# EAGLE design ADF4351_Teensy (EAGLE 9.6.2)
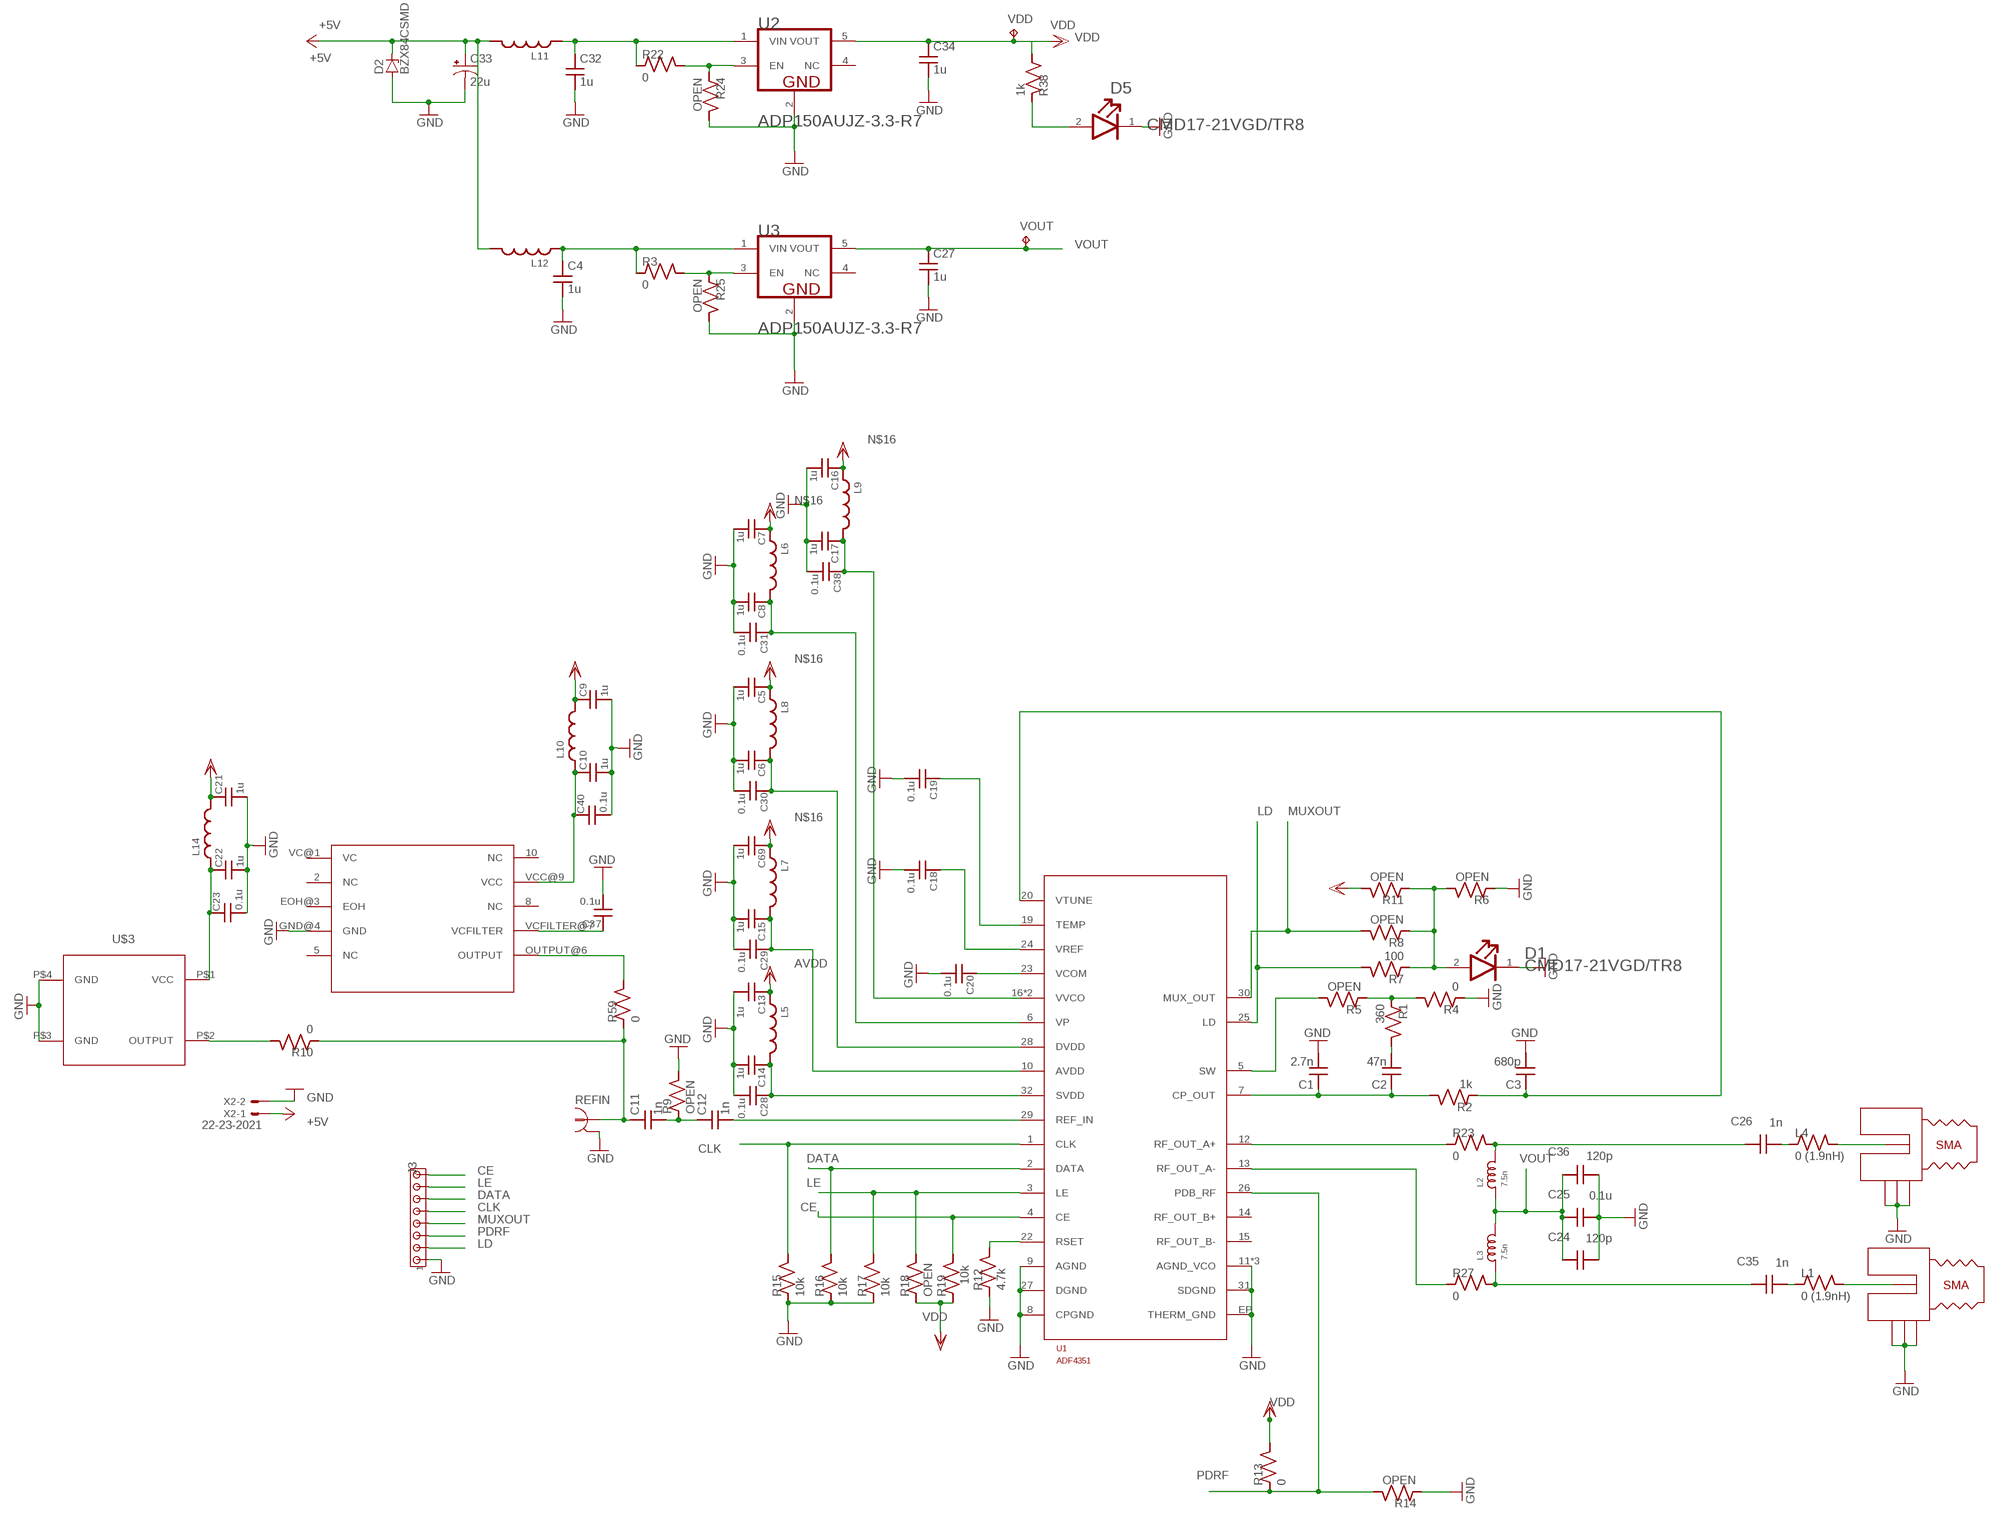
[diagram p0: schematic, sheet 1, part 1 of 2]
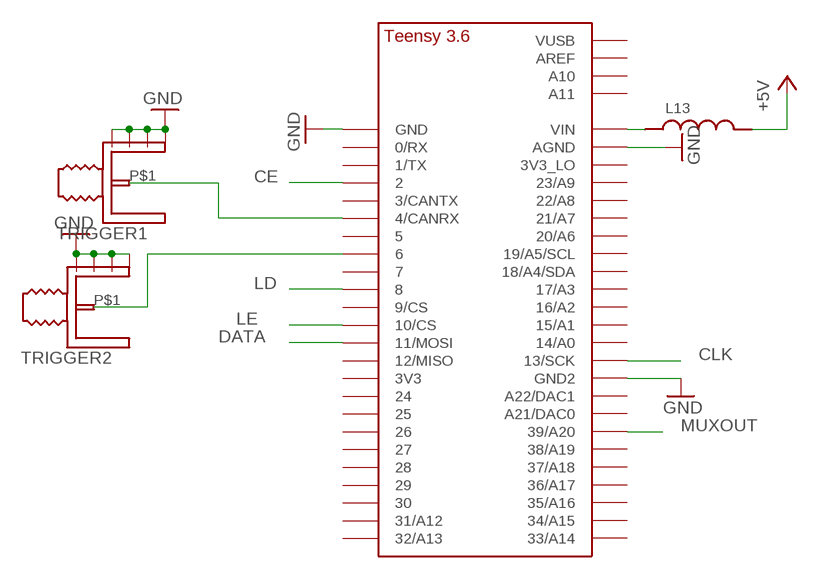
[diagram p1: schematic, sheet 1, part 2 of 2]

## Parts
535L250X2GT5  535L250X2GT5  [535L250X2GT5]
C1  2.7n  C_MLCC_SMDCMLCC_0603  [C_MLCC_0603]
C2  47n  C_MLCC_SMDCMLCC_0603  [C_MLCC_0603]
C3  680p  C_MLCC_SMDCMLCC_0603  [C_MLCC_0603]
C4  1u  C_MLCC_SMDCMLCC_0603  [C_MLCC_0603]
C5  1u  C_MLCC_SMDCMLCC_0306  [C_MLCC_0306]
C6  1u  C_MLCC_SMDCMLCC_0306  [C_MLCC_0306]
C7  1u  C_MLCC_SMDCMLCC_0306  [C_MLCC_0306]
C8  1u  C_MLCC_SMDCMLCC_0306  [C_MLCC_0306]
C9  1u  C_MLCC_SMDCMLCC_0306  [C_MLCC_0306]
C10  1u  C_MLCC_SMDCMLCC_0306  [C_MLCC_0306]
C11  1n  C_MLCC_SMDCMLCC_0603  [C_MLCC_0603]
C12  1n  C_MLCC_SMDCMLCC_0603  [C_MLCC_0603]
C13  1u  C_MLCC_SMDCMLCC_0306  [C_MLCC_0306]
C14  1u  C_MLCC_SMDCMLCC_0306  [C_MLCC_0306]
C15  1u  C_MLCC_SMDCMLCC_0306  [C_MLCC_0306]
C16  1u  C_MLCC_SMDCMLCC_0306  [C_MLCC_0306]
C17  1u  C_MLCC_SMDCMLCC_0306  [C_MLCC_0306]
C18  0.1u  C_MLCC_SMDCMLCC_0204  [C_MLCC_0204]
C19  0.1u  C_MLCC_SMDCMLCC_0204  [C_MLCC_0204]
C20  0.1u  C_MLCC_SMDCMLCC_0204  [C_MLCC_0204]
C21  1u  C_MLCC_SMDCMLCC_0306  [C_MLCC_0306]
C22  1u  C_MLCC_SMDCMLCC_0306  [C_MLCC_0306]
C23  0.1u  C_MLCC_SMDCMLCC_0204  [C_MLCC_0204]
C24  120p  C_MLCC_SMDCMLCC_0402  [C_MLCC_0402]
C25  0.1u  C_MLCC_SMDCMLCC_0402  [C_MLCC_0402]
C26  1n  C_MLCC_SMDCMLCC_0402  [C_MLCC_0402]
C27  1u  C_MLCC_SMDCMLCC_0603  [C_MLCC_0603]
C28  0.1u  C_MLCC_SMDCMLCC_0204  [C_MLCC_0204]
C29  0.1u  C_MLCC_SMDCMLCC_0204  [C_MLCC_0204]
C30  0.1u  C_MLCC_SMDCMLCC_0204  [C_MLCC_0204]
C31  0.1u  C_MLCC_SMDCMLCC_0204  [C_MLCC_0204]
C32  1u  C_MLCC_SMDCMLCC_0603  [C_MLCC_0603]
C33  22u  CPOL-USCT7343  [CT7343]
C34  1u  C_MLCC_SMDCMLCC_0603  [C_MLCC_0603]
C35  1n  C_MLCC_SMDCMLCC_0402  [C_MLCC_0402]
C36  120p  C_MLCC_SMDCMLCC_0402  [C_MLCC_0402]
C37  0.1u  C_MLCC_SMDCMLCC_0204  [C_MLCC_0204]
C38  0.1u  C_MLCC_SMDCMLCC_0204  [C_MLCC_0204]
C40  0.1u  C_MLCC_SMDCMLCC_0204  [C_MLCC_0204]
C69  1u  C_MLCC_SMDCMLCC_0306  [C_MLCC_0306]
D1  VISUAL_COMMUNICATIONS_CMD17-21VGD-TR8VISUAL_COMMUNICATIONS_CMD17-21VGD-TR8_0_0  [VISUAL_COMMUNICATIONS_CMD17-21VGD-TR8_0]
D2  BZX84CSMD  [TO236]
D5  VISUAL_COMMUNICATIONS_CMD17-21VGD-TR8VISUAL_COMMUNICATIONS_CMD17-21VGD-TR8_0_0  [VISUAL_COMMUNICATIONS_CMD17-21VGD-TR8_0]
J1  QKDLAB_JOSH_MECHANICAL_JOHNSON_SMA_18GHZ_142-0761-891  [QKDLAB_JOSH_MECHANICAL_JOHNSON_SMA_18GHZ_4-LAYER_142-0761-891]
J2  QKDLAB_JOSH_MECHANICAL_JOHNSON_SMA_18GHZ_142-0761-891  [QKDLAB_JOSH_MECHANICAL_JOHNSON_SMA_18GHZ_4-LAYER_142-0761-891]
J3  MTA08-100  [10X08MTA]
L1  0 (1.9nH)  R_SMDR0402  [R_0402]
L2  7.5n  INDUCTOR-0402  [0402]
L3  7.5n  INDUCTOR-0402  [0402]
L4  0 (1.9nH)  R_SMDR0402  [R_0402]
L5  L_FERRITE_SMDLFERRITE_0603  [L_FERRITE_0603]
L6  L_FERRITE_SMDLFERRITE_0603  [L_FERRITE_0603]
L7  L_FERRITE_SMDLFERRITE_0603  [L_FERRITE_0603]
L8  L_FERRITE_SMDLFERRITE_0603  [L_FERRITE_0603]
L9  L_FERRITE_SMDLFERRITE_0603  [L_FERRITE_0603]
L10  L_FERRITE_SMDLFERRITE_0603  [L_FERRITE_0603]
L11  L_FERRITE_SMDLFERRITE_0603  [L_FERRITE_0603]
L12  L_FERRITE_SMDLFERRITE_0603  [L_FERRITE_0603]
L13  L_FERRITE_SMDLFERRITE_0603  [L_FERRITE_0603]
L14  L_FERRITE_SMDLFERRITE_0603  [L_FERRITE_0603]
R1  360  R_SMDR0603  [R_0603]
R2  1k  R_SMDR0603  [R_0603]
R3  0  R_SMDR0603  [R_0603]
R4  0  R_SMDR0603  [R_0603]
R5  OPEN  R_SMDR0603  [R_0603]
R6  OPEN  R_SMDR0603  [R_0603]
R7  100  R_SMDR0603  [R_0603]
R8  OPEN  R_SMDR0603  [R_0603]
R9  OPEN  R_SMDR0603  [R_0603]
R10  0  R_SMDR0603  [R_0603]
R11  OPEN  R_SMDR0603  [R_0603]
R12  4.7k  R_SMDR0603  [R_0603]
R13  0  R_SMDR0603  [R_0603]
R14  OPEN  R_SMDR0603  [R_0603]
R15  10k  R_SMDR0603  [R_0603]
R16  10k  R_SMDR0603  [R_0603]
R17  10k  R_SMDR0603  [R_0603]
R18  OPEN  R_SMDR0603  [R_0603]
R19  10k  R_SMDR0603  [R_0603]
R22  0  R_SMDR0603  [R_0603]
R23  0  R_SMDR0402  [R_0402]
R24  OPEN  R_SMDR0603  [R_0603]
R25  OPEN  R_SMDR0603  [R_0603]
R27  0  R_SMDR0402  [R_0402]
R38  1k  R_SMDR0603  [R_0603]
R59  0  R_SMDR0603  [R_0603]
REFIN  SMA_CONNECTOR  [QKDLAB_JOSH_MECHANICAL_JOHNSON_SMA_EDGE_LAUNCH_142-0701-851]
TRIGGER1  JOHNSON_SMA_EDGE_LAUNCH_142-0701-851  [JOHNSON_SMA_EDGE_LAUNCH_142-0701-851]
TRIGGER2  JOHNSON_SMA_EDGE_LAUNCH_142-0701-851  [JOHNSON_SMA_EDGE_LAUNCH_142-0701-851]
U1  ADF4351  [ADF4351]
U2  ANALOG_DEVICES_ADP150AUJZ-3.3-R7ANALOG_DEVICES_ADP150AUJZ-3.3-R7_0_2  [ANALOG_DEVICES_ADP150AUJZ-3.3-R7_2]
U3  ANALOG_DEVICES_ADP150AUJZ-3.3-R7ANALOG_DEVICES_ADP150AUJZ-3.3-R7_0_2  [ANALOG_DEVICES_ADP150AUJZ-3.3-R7_2]
U$1  TEENSY_3.5/3.6_BASIC  [TEENSY_3.5/3.6_BASIC]
U$3  XNCLH25M000THJA0P0  [XNCLH25M000THJA0P0]
VDD  TPB1,27  [B1,27]
VOUT  TPB1,27  [B1,27]
X2  22-23-2021  [22-23-2021]

## Nets
+5V: C33.+ D2.C L11.P$2 L12.P$2 L13.P$2 X2.1
AVDD [chip_pin]: C15.P$1 C29.P$1 L7.P$2 U1.10(AVDD)
CE [chip_pin]: J3.8 R19.P$2 U1.4(CE) U$1.2
CLK [chip_pin]: J3.5 R15.P$2 U1.1(CLK) U$1.13/SCK
CPOUT: C1.P$1 C2.P$1 R2.P$2 U1.7(CP_OUT)
DATA [chip_pin]: J3.6 R16.P$2 U1.2(DATA) U$1.11/MOSI
DVDD [chip_pin]: C6.P$1 C30.P$1 L8.P$2 U1.28(DVDD)
GND: 535L250X2GT5.GND@4(GND) C1.P$2 C3.P$2 C4.P$2 C5.P$2 C6.P$2 C7.P$2 C8.P$2 C9.P$2 C10.P$2 C13.P$2 C14.P$2 C15.P$2 C16.P$2 C17.P$2 C18.P$2 C19.P$2 C20.P$2 C21.P$2 C22.P$2 C23.P$2 C24.P$2 C25.P$2 C27.P$2 C28.P$2 C29.P$2 C30.P$2 C31.P$2 C32.P$2 C33.- C34.P$2 C36.P$2 C37.P$2 C38.P$2 C40.P$2 C69.P$2 D1.1(CATHODE) D2.A D5.1(CATHODE) J1.P$2(GND) J1.P$3(GND) J1.P$4(GND) J2.P$2(GND) J2.P$3(GND) J2.P$4(GND) J3.1 R4.P$1 R6.P$1 R9.P$2 R12.P$1 R14.P$1 R15.P$1 R16.P$1 R17.P$1 R24.P$2 R25.P$2 REFIN.P$2 REFIN.P$3 REFIN.P$4 REFIN.P$5 TRIGGER1.P$2(GND1) TRIGGER1.P$3(GND) TRIGGER1.P$4(GND2) TRIGGER1.P$5(GND3) TRIGGER2.P$2(GND1) TRIGGER2.P$3(GND) TRIGGER2.P$4(GND2) TRIGGER2.P$5(GND3) U1.8(CPGND) U1.9(AGND) U1.11(AGND_VCO) U1.18(AGND_VCO) U1.21(AGND_VCO) U1.27(DGND) U1.31(SDGND) U1.EP(THERM_GND) U2.2(GND) U3.2(GND) U$1.AGND U$1.GND U$1.GND2 U$3.P$3(GND) U$3.P$4(GND) X2.2
LD [chip_pin]: J3.2 R7.P$2 U1.25(LD) U$1.8
LE [chip_pin]: J3.7 R17.P$2 R18.P$2 U1.3(LE) U$1.10/CS
MUXOUT [chip_pin]: J3.4 R8.P$2 U1.30(MUX_OUT) U$1.39/A20
N$1: C26.P$1 L2.2 R23.P$2
N$2: TRIGGER1.P$1 U$1.4/CANRX
N$3: TRIGGER2.P$1 U$1.6
N$4: C35.P$1 L3.1 R27.P$2
N$5: 535L250X2GT5.OUTPUT@6(OUTPUT) R59.P$2
N$6: C11.P$1 R10.P$1 R59.P$1 REFIN.P$1
N$7: 535L250X2GT5.VCC@9(VCC) C10.P$1 C40.P$1 L10.P$1
N$8: C11.P$2 C12.P$1 R9.P$1
N$9: 535L250X2GT5.VCFILTER@7(VCFILTER) C37.P$1
N$10: D1.2(ANODE) R6.P$2 R7.P$1 R8.P$1 R11.P$1
N$11: R1.P$1 R4.P$2 R5.P$1
N$12: C2.P$2 R1.P$2
N$14: C4.P$1 L12.P$1 R3.P$1 U3.1(VIN)
N$15: L13.P$1 U$1.VIN
N$17: C26.P$2 L4.P$1
N$18: C35.P$2 L1.P$1
N$19: J1.P$1(SIG) L4.P$2
N$20: J2.P$1(SIG) L1.P$2
N$21: R3.P$2 R25.P$1 U3.3(EN)
N$22: R22.P$2 R24.P$1 U2.3(EN)
N$23: C18.P$1 U1.24(VREF)
N$24: R10.P$2 U$3.P$2(OUTPUT)
N$25: C32.P$1 L11.P$1 R22.P$1 U2.1(VIN)
N$26: D5.2(ANODE) R38.P$1
N$27: C22.P$1 C23.P$1 L14.P$1 U$3.P$1(VCC)
PDRF [chip_pin]: J3.3 R13.P$1 R14.P$2 U1.26(PDB_RF)
REFIN: C12.P$2 U1.29(REF_IN)
RFOUTAM [chip_pin]: R27.P$1 U1.13(RF_OUT_A-)
RFOUTAP [chip_pin]: R23.P$1 U1.12(RF_OUT_A+)
RSET [chip_pin]: R12.P$2 U1.22(RSET)
SVDD [chip_pin]: C14.P$1 C28.P$1 L5.P$2 U1.32(SVDD)
SW: R5.P$2 U1.5(SW)
TEMP [chip_pin]: C19.P$1 U1.19(TEMP)
VCO [chip_pin]: C17.P$1 C38.P$1 L9.P$2 U1.16(VVCO) U1.17(VVCO)
VCOM [chip_pin]: C20.P$1 U1.23(VCOM)
VDD [chip_pin]: C5.P$1 C7.P$1 C9.P$1 C13.P$1 C16.P$1 C21.P$1 C34.P$1 C69.P$1 L5.P$1 L6.P$1 L7.P$1 L8.P$1 L9.P$1 L10.P$2 L14.P$2 R11.P$2 R13.P$2 R18.P$1 R19.P$1 R38.P$2 U2.5(VOUT) VDD.TP
VOUT: C24.P$1 C25.P$1 C27.P$1 C36.P$1 L2.1 L3.2 U3.5(VOUT) VOUT.TP
VP [chip_pin]: C8.P$1 C31.P$1 L6.P$2 U1.6(VP)
VTUNE [chip_pin]: C3.P$1 R2.P$1 U1.20(VTUNE)
Unconnected: 535L250X2GT5.2(NC) 535L250X2GT5.5(NC) 535L250X2GT5.8(NC) 535L250X2GT5.10(NC) 535L250X2GT5.EOH@3(EOH) 535L250X2GT5.VC@1(VC) U1.14(RF_OUT_B+) U1.15(RF_OUT_B-) U2.4(NC) U3.4(NC) U$1.0/RX U$1.1/TX U$1.3/CANTX U$1.3V3 U$1.3V3_LO U$1.5 U$1.7 U$1.9/CS U$1.12/MISO U$1.14/A0 U$1.15/A1 U$1.16/A2 U$1.17/A3 U$1.18/A4/SDA U$1.19/A5/SCL U$1.20/A6 U$1.21/A7 U$1.21/DAC0(A21/DAC0) U$1.22/A8 U$1.23/A9 U$1.24 U$1.25 U$1.26 U$1.27 U$1.28 U$1.29 U$1.30 U$1.31/A12 U$1.32/A13 U$1.33/A14 U$1.34/A15 U$1.35/A16 U$1.36/A17 U$1.37/A18 U$1.38/A19 U$1.A10 U$1.A11 U$1.A22/DAC1 U$1.AREF U$1.VUSB

## Library data of the parts
535L250X2GT5 = 535L250X2GT5:535L250X2GT5
C1 = jqi_passives:C_MLCC_SMD; DIGIKEY_PART_NUMBER: 1276-2022-1-ND; PART_NUMBER: CL10B272KB8NNNC
C2 = jqi_passives:C_MLCC_SMD; DIGIKEY_PART_NUMBER: 1276-2070-1-ND; PART_NUMBER: CL10B473JB8NNNC
C3 = jqi_passives:C_MLCC_SMD; DIGIKEY_PART_NUMBER: 1276-2327-1-ND; PART_NUMBER: CL10C681FB8NNNC
C4 C27 C32 C34 = jqi_passives:C_MLCC_SMD; DIGIKEY_PART_NUMBER: 1276-1019-1-ND; PART_NUMBER: CL10B105KO8NNNC
C5-C10 C13-C17 C21 C22 C69 = jqi_passives:C_MLCC_SMD; DIGIKEY_PART_NUMBER: 445-13750-1-ND; PART_NUMBER: C0816X5R1C105M050AC
C11 C12 = jqi_passives:C_MLCC_SMD; DIGIKEY_PART_NUMBER: 1276-1091-1-ND; PART_NUMBER: CL10C102JB8NNNC
C18-C20 C23 C28-C31 C37 C38 C40 = jqi_passives:C_MLCC_SMD; DIGIKEY_PART_NUMBER: 587-5137-1-ND; PART_NUMBER: LWK105C7104MP-F
C24 C36 = jqi_passives:C_MLCC_SMD; DIGIKEY_PART_NUMBER: 587-3738-1-ND; PART_NUMBER: UMK105CG121JVHF
C25 = jqi_passives:C_MLCC_SMD; DIGIKEY_PART_NUMBER: 587-1451-1-ND; PART_NUMBER: EMK105B7104KV-F
C26 C35 = jqi_passives:C_MLCC_SMD; DIGIKEY_PART_NUMBER: 1276-1635-1-ND; PART_NUMBER: CL05C102JB5NNNC
C33 = rcl:CPOL-US: POLARIZED CAPACITOR, American symbol; DIGIKEY_PART_NUMBER: 478-3923-1-ND; PART_NUMBER: TAJD226K020RNJ; SPICEPREFIX: C
D1 = Diode_TR8:VISUAL_COMMUNICATIONS_CMD17-21VGD-TR8: CHICAGO MINIATURE LIGHTING CMD17-21VGD/TR8 LED, GREEN, 1.25MM X 1.4MM, 7MCD, 570NM; CENTROID_NOT_SPECIFIED: No; COLOUR: Green; DATASHEET: https://www.vcclite.com/wp-content/uploads/wpallimport/files/files/CMD1721Seriesver3.pdf; DEVICE_CLASS_L1: Optoelectronics; DEVICE_CLASS_L2: LEDs; DEVICE_CLASS_L3: unset; DIGIKEY_DESCRIPTION: DIODE LED GREEN DIFFUSED 0805 SMD; DIGIKEY_PART_NUMBER: L62505CT-ND; FORWARD_CURRENT: 20mA; FORWARD_VOLTAGE: 2.1V; HEIGHT: 1.2mm; LEAD_FREE: yes; LED_ORIENTATION: Top View; LUMINOUS_INTENSITY: 7mcd; MF: Visual Communications; MFG_PACKAGE_IDENT: CMD17-21VGD/TR8; MFG_PACKAGE_IDENT_DATE: 0; MFG_PACKAGE_IDENT_REV: 0; MOUSER_DESCRIPTION: Standard LEDs - SMD GREEN DIFFUSED; MOUSER_PART_NUMBER: 606-CMD17-21VGD; MPN: CMD17-21VGD/TR8; PACKAGE: 0805 (2012 metric); POWER_DISSIPATION: 105mW; PREFIX: D; REVERSE_VOLTAGE: 5V; ROHS: yes; TEMPERATURE_RANGE_HIGH: +85°C; TEMPERATURE_RANGE_LOW: -40°C; VERIFICATION_VERSION: 0.0.0.1; VIEWING_ANGLE: 140°; WAVELENGTH: 570nm
D2 = diode:BZX84CSMD: Z DIODE; DIGIKEY_PART_NUMBER: 1727-2942-1-ND; PART_NUMBER: BZX84-C6V8,215
D5 = Diode_TR8:VISUAL_COMMUNICATIONS_CMD17-21VGD-TR8: CHICAGO MINIATURE LIGHTING CMD17-21VGD/TR8 LED, GREEN, 1.25MM X 1.4MM, 7MCD, 570NM; CENTROID_NOT_SPECIFIED: No; COLOUR: Green; DATASHEET: https://www.vcclite.com/wp-content/uploads/wpallimport/files/files/CMD1721Seriesver3.pdf; DEVICE_CLASS_L1: Optoelectronics; DEVICE_CLASS_L2: LEDs; DEVICE_CLASS_L3: unset; DIGIKEY_DESCRIPTION: DIODE LED GREEN DIFFUSED 0805 SMD; DIGIKEY_PART_NUMBER: L62501CT-ND; FORWARD_CURRENT: 20mA; FORWARD_VOLTAGE: 2.1V; HEIGHT: 1.2mm; LEAD_FREE: yes; LED_ORIENTATION: Top View; LUMINOUS_INTENSITY: 7mcd; MF: Visual Communications; MFG_PACKAGE_IDENT: CMD17-21VRD/TR8; MFG_PACKAGE_IDENT_DATE: 0; MFG_PACKAGE_IDENT_REV: 0; MOUSER_DESCRIPTION: Standard LEDs - SMD GREEN DIFFUSED; MOUSER_PART_NUMBER: 606-CMD17-21VGD; MPN: CMD17-21VRD/TR8; PACKAGE: 0805 (2012 metric); POWER_DISSIPATION: 105mW; PREFIX: D; REVERSE_VOLTAGE: 5V; ROHS: yes; TEMPERATURE_RANGE_HIGH: +85°C; TEMPERATURE_RANGE_LOW: -40°C; VERIFICATION_VERSION: 0.0.0.1; VIEWING_ANGLE: 140°; WAVELENGTH: 570nm
J1 J2 = SMA_connectors:QKDLAB_JOSH_MECHANICAL_JOHNSON_SMA_18GHZ_142-0761-891: Emerson 142-0761-891 High Frequency SMA End Launch Connector; DIGIKEY_PART_NUMBER: J802-ND; PART_NUMBER: 142-0761-891
J3 = con-amp:MTA08-100: AMP connector
L1 L4 R23 R27 = jqi_passives:R_SMD; DIGIKEY_PART_NUMBER: 541-1887-1-ND; PART_NUMBER: RCG04020000Z0ED
L2 L3 = rlc-jqi:INDUCTOR: SMT Inductor.; DIGIKEY_PART_NUMBER: A102558CT-ND; PART_NUMBER: 36501E7N5JTDG
L5-L14 = jqi_passives:L_FERRITE_SMD; DIGIKEY_PART_NUMBER: 490-17350-1-ND; PART_NUMBER: BLM18KG102SZ1D
R1 = jqi_passives:R_SMD; DIGIKEY_PART_NUMBER: P360GCT-ND; PART_NUMBER: ERJ-3GEYJ361V
R2 R38 = jqi_passives:R_SMD; DIGIKEY_PART_NUMBER: P1.0KDBCT-ND; PART_NUMBER: ERA-3AEB102V
R3 R4 R10 R13 R22 R59 = jqi_passives:R_SMD; DIGIKEY_PART_NUMBER: 541-4012-1-ND; PART_NUMBER: CRCW06030000Z0EAC
R5 R6 R8 R11 R14 R24 R25 = jqi_passives:R_SMD
R7 = jqi_passives:R_SMD; DIGIKEY_PART_NUMBER: 541-3951-1-ND; PART_NUMBER: CRCW0603100RFKEAC
R9 R15-R19 = jqi_passives:R_SMD; DIGIKEY_PART_NUMBER: MCT0603-10.0K-CFCT-ND; PART_NUMBER: MCT06030C1002FP500
R12 = jqi_passives:R_SMD; DIGIKEY_PART_NUMBER: 541-3993-1-ND; PART_NUMBER: CRCW06034K70JNEAC
REFIN = SMA_connectors:SMA_CONNECTOR; DIGIKEY_PART_NUMBER: J658-ND; PART_NUMBER: 142-0701-851
TRIGGER1 TRIGGER2 = connector-jqi:JOHNSON_SMA_EDGE_LAUNCH_142-0701-851
U1 = ADF4351:ADF4351: IC SYNTH PLL VCO 32LFCSP Check prices <https://pricing.snapeda.com/parts/ADF4351/Analog%20Devices/view-part?ref=eda>; AVAILABILITY: Bad; DESCRIPTION: IC SYNTH PLL VCO 32LFCSP; MF: Analog Devices; MP: ADF4351; PACKAGE: LFCSP-32 Analog Devices; PRICE: None
U2 U3 = Analog Devices - ADP150AUJZ-3.3-R7:ANALOG_DEVICES_ADP150AUJZ-3.3-R7: ADI-ADP1XX-UJ-5; CIIVA_IDS: 975179; CODE__JEDEC: MO-193-AB; COMPONENT_LINK_1_DESCRIPTION: Manufacturer URL; COMPONENT_LINK_1_URL: http://www.analog.com/en/index.html; COMPONENT_LINK_3_DESCRIPTION: Package Specification; COMPONENT_LINK_3_URL: http:/www.analog.com/static/imported-files/packages/PKG_PDF/TSOT(UJ)/UJ_5.pdf; COMPONENT_LINK_4_DESCRIPTION: URL Link1; COMPONENT_LINK_4_URL: Product URL:http://www.analog.com/en/ADP150/productSearch.html; DATASHEET: http://www.analog.com/static/imported-files/data_sheets/ADP150.pdf; DATASHEET_VERSION: Rev. A; FOOTPRINT_VARIANT_NAME_0: Level C; FOOTPRINT_VARIANT_NAME_1: Level B; FOOTPRINT_VARIANT_NAME_2: Level A; IMPORTED: yes; IMPORTED_FROM: vault; IMPORT_TS: 1521857608; IOUT_MAX: 150mA; MF: Analog Devices; MOUNTING_TECHNOLOGY: Surface Mount; MPN: ADP150AUJZ-3.3-R7; PACKAGE: UJ-5; PACKAGE_DESCRIPTION: 5-Pin Thin Small Outline Transistor Package, Body 2.9 x 1.6 mm, Pitch 0.95 mm; PACKAGE_VERSION: 100708-A, 10/2008; PACKING: Reel; PREFIX: U; PRESET_VOUT_VALUES_V: 3.3; RELEASE_DATE: 1391079503; SUPPLY_CURRENT_IGND__SMALL_LOAD: 10uA; VAULT_GUID: 70507598-8A6A-4FF9-A6C4-4DAE49C689A6; VAULT_REVISION: BD3AA6A0-0F13-46D0-8547-DEEA94063516; VIN_MAX_V: 5.5; VIN_MIN_V: 2.2
U$1 = Teensy356:TEENSY_3.5/3.6_BASIC
U$3 = XNCLH25M000THJA0P0:XNCLH25M000THJA0P0; DIGIKEY_PART_NUMBER_25: 490-XNCLH25M000CHJB9P0CT-ND; DIGIKEY_PART_NUMBER_50: 490-18056-1-ND; PART_NUMBER_25: XNCLH25M000CHJB9P0; PART_NUMBER_50: XNCLH50M000CHJA1P0
VDD VOUT = testpad:TP: Test pad
X2 = con-molex:22-23-2021: .100" (2.54mm) Center Header - 2 Pin; MF: MOLEX; MPN: 22-23-2021; OC_FARNELL: 1462926; OC_NEWARK: 25C3832

## Net classes
0 default: width 0.254 mm, drill 0.254 mm, clearance 0.254 mm
1 chip_pin: width 0.254 mm, drill 0.254 mm, clearance 0.127 mm to class 0, clearance 0.127 mm

## Board
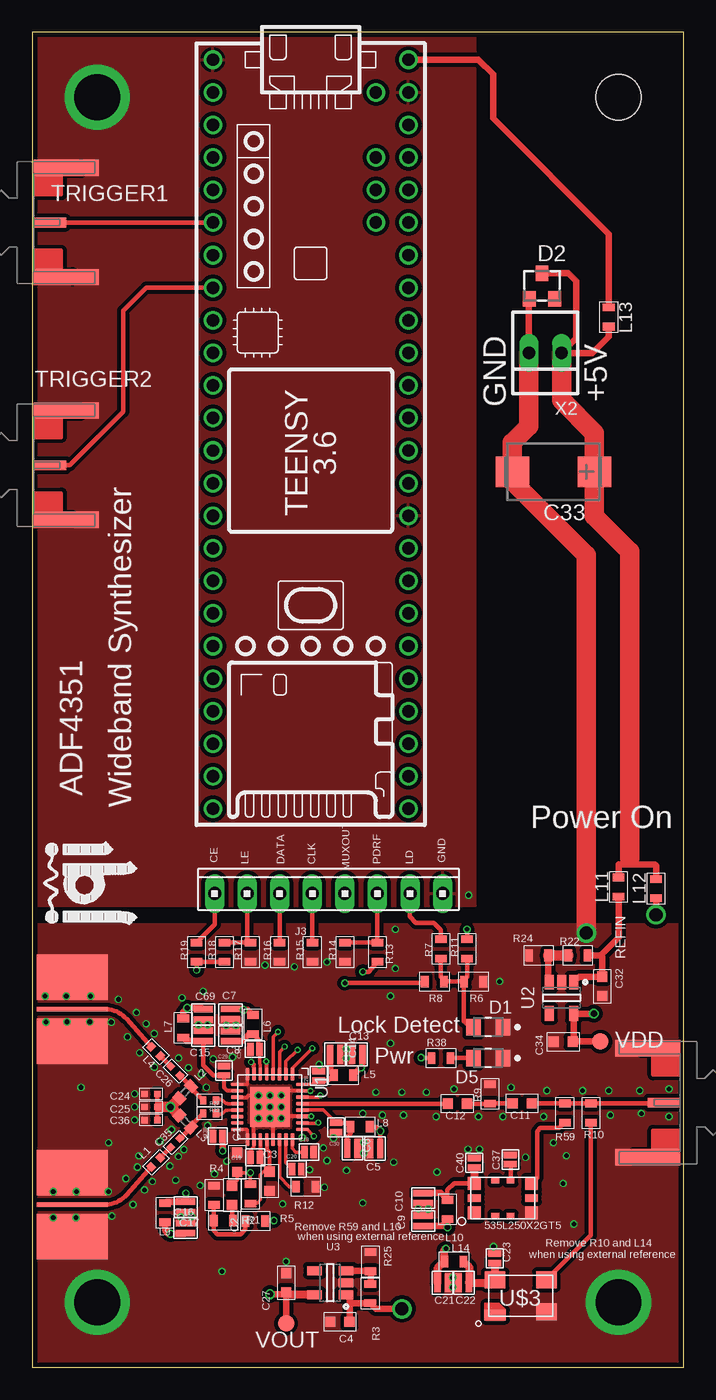
[diagram p2: board, top side]
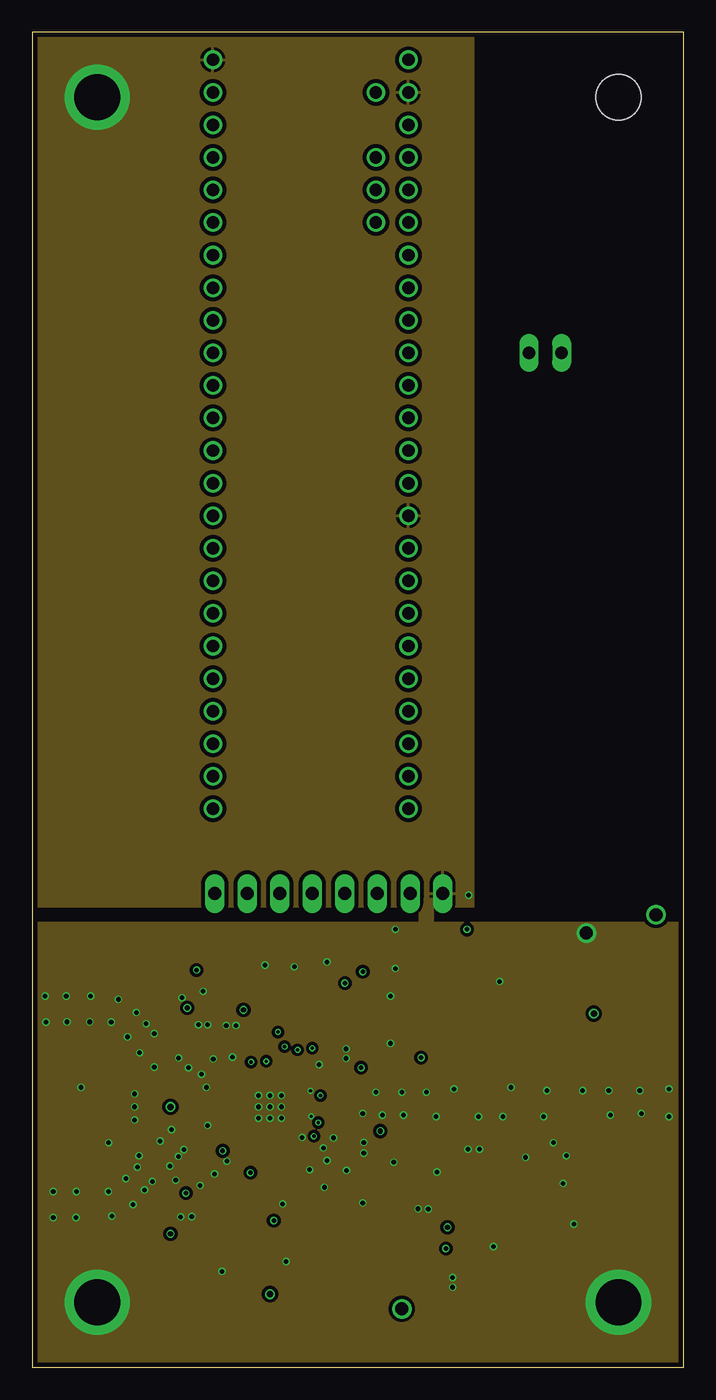
[diagram p3: board, inner layer Route2]
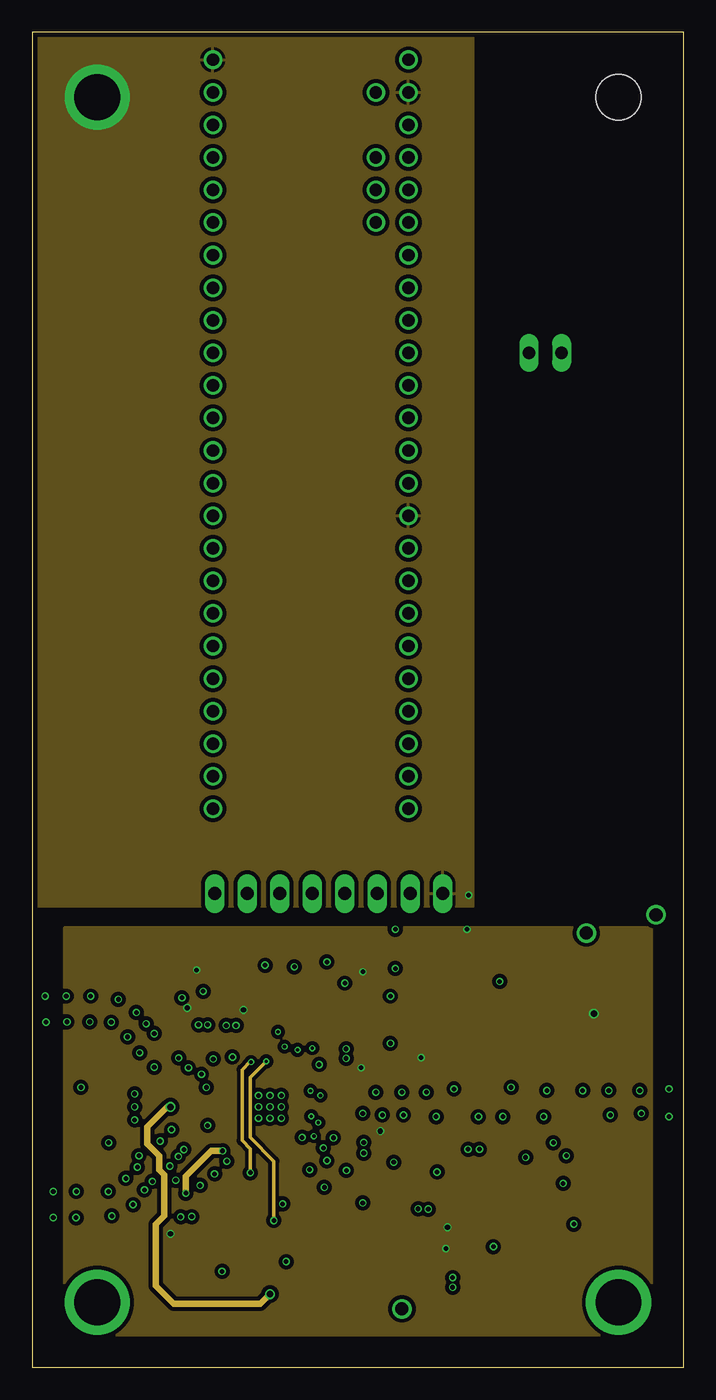
[diagram p4: board, inner layer Route15]
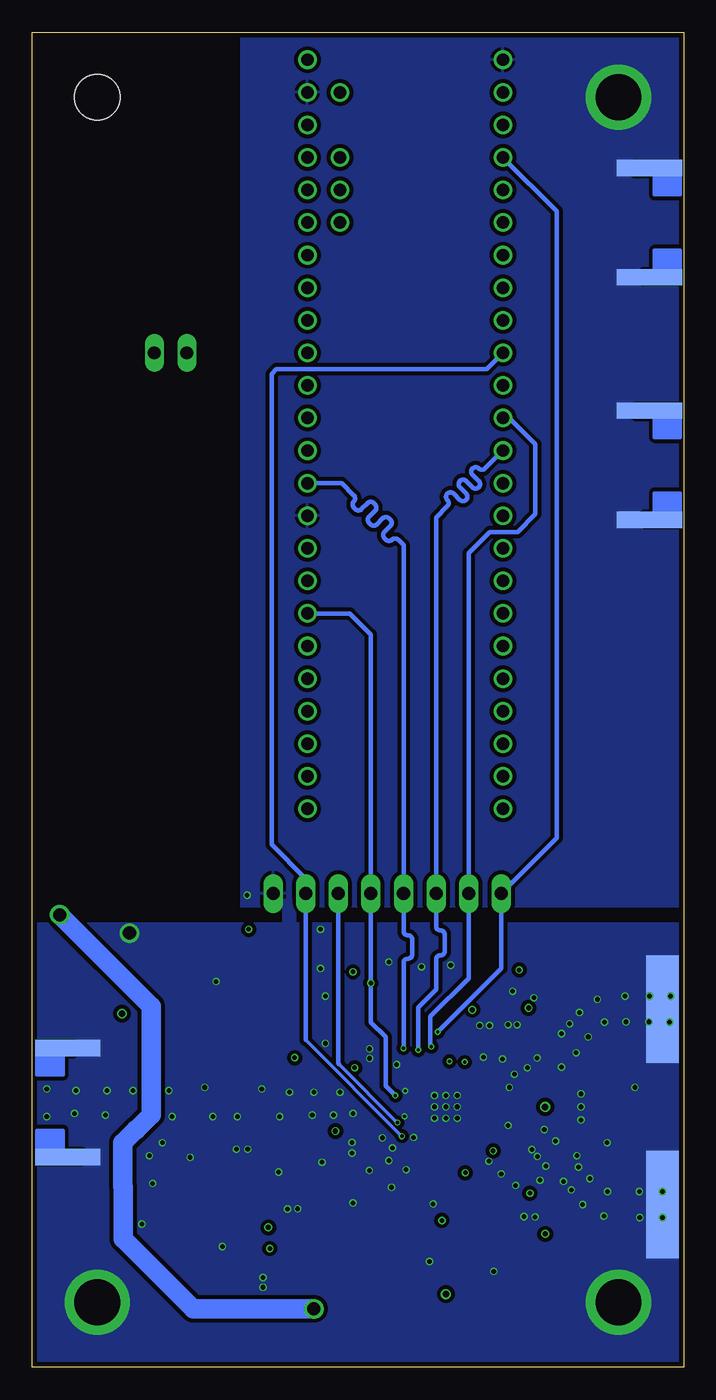
[diagram p5: board, bottom side, seen from below]

Size 50.8 x 104.14 mm. Coordinates in mm from the lower left corner, seen from the top.
Outline: 0,0 50.8,0 50.8,104.14 0,104.14 0,0
Copper layers (1*2*15*16): Top 0.035559375mm / dielectric 0.17018125mm / Route2 0.01778125mm / dielectric 47mil / Route15 0.01778125mm / dielectric 0.17018125mm / Bottom 0.035559375mm
Design rules "oshpark-4layer": minimum track width 5mil, minimum drill 10mil, track to track 5mil, track to pad 5mil, pad to pad 5mil, via to via 5mil, smd to smd 5mil, copper to edge 15mil, drill to drill 6mil, minimum pad ring 4mil, minimum via ring 4mil, stop-mask expansion 1.5mil, vias tented up to drill 0mil, thermal gap 10mil
Holes 3.56 mm at 45.72,99.06

### Footprints (pad centres in the part's own frame; a part is rotated, then mirrored left to right if it is on the bottom)
535L250X2GT5 = smd 0.6 x 0.5: 2 -0.6,-1.4; 8 -0.6,1.4; EOH@3 0.6,-1.4; VCFILTER@7 0.6,1.4 | smd 1 x 0.6: 5 2.225,0; 10 -2.225,0 | smd 1 x 1: GND@4 2.225,-1.15; OUTPUT@6 2.225,1.15; VC@1 -2.225,-1.15; VCC@9 -2.225,1.15
C_MLCC_0603 = smd 0.8 x 0.8: P$1 -0.75,0; P$2 0.75,0
C_MLCC_0306 = smd 0.5 x 1.5: P$1 -0.4,0; P$2 0.4,0
C_MLCC_0204 = smd 0.5 x 1: P$1 -0.36,0; P$2 0.36,0
C_MLCC_0402 = smd 0.5 x 0.5: P$1 -0.5,0; P$2 0.5,0
CT7343 = smd 2.6 x 2.4: + -3.2,0; - 3.2,0
VISUAL_COMMUNICATIONS_CMD17-21VGD-TR8_0 = smd 1.1 x 1.3: 1 -1.15,0; 2 1.15,0
TO236 = smd 1 x 1.2: A -1,-1; C 0,1; NC 1,-1
QKDLAB_JOSH_MECHANICAL_JOHNSON_SMA_18GHZ_4-LAYER_142-0761-891 = smd 0.356 x 5.537: P$1 0,-2.769 | smd 3.556 x 5.537: P$2 2.489,-2.769; P$3 -2.489,-2.769 | smd 8.382 x 2.54 bottom: P$4 0,-1.27
10X08MTA = drill 1.016 long: 1 8.89,0; 2 6.35,0; 3 3.81,0; 4 1.27,0; 5 -1.27,0; 6 -3.81,0; 7 -6.35,0; 8 -8.89,0
R_0402 = smd 0.5 x 0.6: P$1 -0.5,0; P$2 0.5,0
0402 = smd 0.7 x 0.9: 1 -0.65,0; 2 0.65,0
L_FERRITE_0603 = smd 0.6 x 0.9: P$1 -0.75,0; P$2 0.75,0
R_0603 = smd 0.6 x 0.9: P$1 -0.75,0; P$2 0.75,0
QKDLAB_JOSH_MECHANICAL_JOHNSON_SMA_EDGE_LAUNCH_142-0701-851 = smd 2.54 x 0.762: P$1 -1.27,0 | smd 5.08 x 1.27: P$2 -2.54,4.255; P$3 -2.54,-4.255 | smd 5.08 x 1.27 bottom: P$4 -2.54,4.255; P$5 -2.54,-4.255
JOHNSON_SMA_EDGE_LAUNCH_142-0701-851 = smd 2.54 x 0.762: P$1 -1.27,0 | smd 5.08 x 1.27: P$2 -2.54,4.255; P$3 -2.54,-4.255 | smd 5.08 x 1.27 bottom: P$4 -2.54,4.255; P$5 -2.54,-4.255
ADF4351 = smd 1 x 0.3: 1 -2.55,1.75; 2 -2.55,1.25; 3 -2.55,0.75; 4 -2.55,0.25; 5 -2.55,-0.25; 6 -2.55,-0.75; 7 -2.55,-1.25; 8 -2.55,-1.75; 17 2.55,-1.75; 18 2.55,-1.25; 19 2.55,-0.75; 20 2.55,-0.25; 21 2.55,0.25; 22 2.55,0.75; 23 2.55,1.25; 24 2.55,1.75 | smd 0.3 x 1: 9 -1.75,-2.55; 10 -1.25,-2.55; 11 -0.75,-2.55; 12 -0.25,-2.55; 13 0.25,-2.55; 14 0.75,-2.55; 15 1.25,-2.55; 16 1.75,-2.55; 25 1.75,2.55; 26 1.25,2.55; 27 0.75,2.55; 28 0.25,2.55; 29 -0.25,2.55; 30 -0.75,2.55; 31 -1.25,2.55; 32 -1.75,2.55 | smd 3.1 x 3.1: EP 0,0
ANALOG_DEVICES_ADP150AUJZ-3.3-R7_2 = smd 1.15 x 0.7: 1 -1.225,0.95; 2 -1.225,0; 3 -1.225,-0.95; 4 1.225,-0.95; 5 1.225,0.95
TEENSY_3.5/3.6_BASIC = drill 0.965: 0/RX -25.4,-7.62; 1/TX -22.86,-7.62; 2 -20.32,-7.62; 3/CANTX -17.78,-7.62; 3V3 7.62,-7.62; 3V3_LO -22.86,7.62; 4/CANRX -15.24,-7.62; 5 -12.7,-7.62; 6 -10.16,-7.62; 7 -7.62,-7.62; 8 -5.08,-7.62; 9/CS -2.54,-7.62; 10/CS 0,-7.62; 11/MOSI 2.54,-7.62; 12/MISO 5.08,-7.62; 13/SCK 5.08,7.62; 14/A0 2.54,7.62; 15/A1 0,7.62; 16/A2 -2.54,7.62; 17/A3 -5.08,7.62; 18/A4/SDA -7.62,7.62; 19/A5/SCL -10.16,7.62; 20/A6 -12.7,7.62; 21/A7 -15.24,7.62; 21/DAC0 12.7,7.62; 22/A8 -17.78,7.62; 23/A9 -20.32,7.62; 24 10.16,-7.62; 25 12.7,-7.62; 26 15.24,-7.62; 27 17.78,-7.62; 28 20.32,-7.62; 29 22.86,-7.62; 30 25.4,-7.62; 31/A12 27.94,-7.62; 32/A13 30.48,-7.62; 33/A14 30.48,7.62; 34/A15 27.94,7.62; 35/A16 25.4,7.62; 36/A17 22.86,7.62; 37/A18 20.32,7.62; 38/A19 17.78,7.62; 39/A20 15.24,7.62; A10 -17.78,5.08; A11 -15.24,5.08; A22/DAC1 10.16,7.62; AGND -25.4,7.62; AREF -20.32,5.08; GND -27.94,-7.62; GND2 7.62,7.62; VIN -27.94,7.62; VUSB -25.4,5.08
XNCLH25M000THJA0P0 = smd 1.6 x 1.3: P$1 -2,1.25; P$2 2,1.25; P$3 2,-1.25 | smd 1.676 x 0.813: P$4 -2,-1.5
B1,27 = smd 1.27 x 1.27: TP 0,0
22-23-2021 = drill 1 long: 1 -1.27,0; 2 1.27,0

### Placement (x,y rotation side)
535L250X2GT5  36.7,13.21 0 top
C1  16,16 90 top
C2  15.6,13.44 270 top
C3  18.52,14.53 270 top
C4  24,3.56 180 top
C5  26.75,17.07 180 top
C6  24.97,17.09 0 top
C7  15.47,27.56 270 top
C8  15.47,25.83 90 top
C9  30.48,11.43 90 top
C10  30.48,13.21 270 top
C11  38.2,20.6 180 top
C12  33.15,20.57 180 top
C13  25.35,24.41 180 top
C14  23.62,24.41 0 top
C15  13.34,25.86 90 top
C16  11.96,10.87 90 top
C17  11.99,12.52 270 top
C18  21.59,16.79 0 top
C19  17.4,16.38 180 top
C20  20.62,15.47 0 top
C21  32,6.6 0 top
C22  33.66,6.6 180 top
C23  36.07,8.51 90 top
C24  9.27,21.34 180 top
C25  9.27,20.32 180 top
C26  11.18,23.11 135 top
C27  19.81,6.6 90 top
C28  22.35,22.73 90 top
C29  14.96,23.14 90 top
C30  23.7,18.72 270 top
C31  17.37,24.82 180 top
C32  44.45,29.72 270 top
C33  40.64,69.85 180 top
C34  41.4,25.4 180 top
C35  11.18,17.53 225 top
C36  9.27,19.3 180 top
C37  37.29,16.21 90 top
C38  14.48,18.03 180 top
C40  34.47,15.95 90 top
C69  13.34,27.53 270 top
D1  35.56,26.54 180 top
D2  39.75,84.33 0 top
D5  35.56,24.13 180 top
J1  0.38,27.94 90 top
J2  0.38,12.7 90 top
J3  23.11,36.96 0 top
L1  9.65,16 225 top
L2  11.94,21.46 45 top
L3  11.94,19.18 135 top
L4  9.65,24.64 135 top
L5  24.28,22.81 180 top
L6  17.22,26.75 270 top
L7  11.79,26.47 270 top
L8  25.58,18.77 180 top
L9  10.36,12.07 90 top
L10  32.38,12.32 270 top
L11  45.72,37.46 90 top
L12  48.64,37.34 90 top
L13  44.96,81.92 270 top
L14  32.89,8.25 180 top
R1  14.91,11.46 0 top
R2  17.02,13.54 90 top
R3  26.37,5.77 90 top
R4  14.2,13.44 270 top
R5  17.4,11.43 0 top
R6  34.42,30.1 180 top
R7  31.88,32.64 90 top
R8  31.37,30.1 180 top
R9  35.69,21.34 90 top
R10  43.56,19.84 270 top
R11  33.91,32.64 90 top
R12  21.34,14.1 180 top
R13  26.92,32.38 270 top
R14  24.38,32.38 90 top
R15  21.84,32.38 90 top
R16  19.3,32.38 90 top
R17  17.02,32.38 90 top
R18  14.99,32.38 90 top
R19  12.83,32.38 90 top
R22  42.55,32.13 180 top
R23  13.84,20.83 180 top
R24  39.5,32.13 180 top
R25  26.39,8.25 90 top
R27  13.84,19.81 180 top
R38  31.88,24.13 180 top
R59  41.53,19.84 270 top
REFIN  50.55,20.65 0 top
TRIGGER1  0.13,89.28 180 top
TRIGGER2  0.13,70.36 180 top
U1  18.54,20.32 270 top
U2  41.27,28.83 270 top
U3  23.24,6.6 180 top
U$1  21.72,74.04 270 top
U$2  [JQI_LOGO_POSITIVE-SILKSCREEN]  7.87,34.29 90 top
U$3  38.1,5.59 0 top
VDD  44.3,25.43 0 top
VOUT  19.81,3.43 270 top
X2  40.01,79.12 180 top

### Tracks (layer width: path | path; a pad name or v marks a point on that pad's centre or on a via)
+5V
  Top 0.508: L11.P$2 45.72,39.24 46.1,39.24 | 46.1,39.24 48.51,39.24 48.64,39.12 L12.P$2 | D2.C 41.8,85.33 42.42,84.71 42.42,80.26 X2.1 43.69,79.12 44.96,80.39 L13.P$2 | 46.61,39.75 46.1,39.24
  Top 1.524: X2.1 41.27,75.44 43.84,72.87 C33.+ 43.84,66.4 46.61,63.63 46.61,39.75
AVDD
  Top 0.305: U1.10 15.23,21.57 14.99,21.82 14.99,22.75 C29.P$1
  Top 0.356: C29.P$1 14.12,22.78 13.34,23.56 C15.P$1
  Top 0.508: C15.P$1 12.04,25.46 L7.P$2
CE  (via drill 0.25)
  Top 0.254: U1.4 18.79,25.78 v19.18,26.16
  Top 0.356: J3.8 14.22,34.53 R19.P$2
  Bottom 0.356: v19.18,26.16 14.22,31.11 J3.8 9.91,41.27 9.91,90.17 U$1.2
CLK  (via drill 0.25)
  Top 0.254: U1.1 20.29,23.34 v21.84,24.89
  Top 0.356: J3.5 R15.P$2
  Bottom 0.356: v21.84,24.89 21.84,31.54 arc90 21.51,31.88 21.5,31.88 arc-90 21.16,32.21 21.16,33.36 arc-90 21.5,33.7 21.51,33.7 arc90 21.84,34.04 J3.5 21.84,64.14 22.27,64.56 arc-90 22.74,64.56 arc90 23.22,64.56 23.34,64.67 arc90 23.34,65.15 22.86,65.63 arc-90 22.86,66.1 22.98,66.22 arc-90 23.46,66.22 23.93,65.75 arc90 24.41,65.75 24.53,65.87 arc90 24.53,66.34 24.05,66.82 arc-90 24.05,67.29 24.17,67.41 arc-90 24.65,67.41 25.12,66.94 arc90 25.6,66.94 25.72,67.06 arc90 25.72,67.53 arc-90 25.72,68.01 26.67,68.96 U$1.13/SCK
CPOUT  (via drill 0.25, 0.36)
  Top 0.254: U1.7 17.29,23.39 | R2.P$2 v17.02,15.19 16.07,15.19 C1.P$1 16,14.59 C2.P$1
  Top 0.305: 17.29,23.39 17.29,23.6 v17.08,23.82
  Route15 0.254: v17.08,23.82 16.98,23.82 16.38,23.22 16.38,17.7 17.02,17.06 v17.02,15.19
DATA  (via drill 0.25)
  Top 0.254: U1.2 19.79,23.86 v20.7,24.77
  Top 0.356: J3.6 R16.P$2
  Bottom 0.356: v20.7,24.77 20.7,28.07 19.3,29.46 19.3,31.8 arc90 18.97,32.14 arc-90 18.63,32.47 18.63,33.74 arc-90 18.97,34.08 arc90 19.3,34.42 J3.6 19.3,66.29 18.43,67.17 arc-90 18.43,67.65 18.43,67.66 arc90 18.43,68.13 18.42,68.15 arc90 17.94,68.15 17.45,67.65 arc-90 16.97,67.65 16.96,67.67 arc-90 16.96,68.15 17.45,68.64 arc90 17.45,69.12 17.44,69.13 arc90 16.96,69.13 16.47,68.64 arc-90 15.99,68.64 15.97,68.65 arc-90 15.97,69.13 16.47,69.62 arc90 16.47,70.1 16.45,70.11 arc90 15.98,70.11 15.97,70.1 arc-90 15.49,70.1 U$1.11/MOSI
DVDD
  Top 0.254: U1.28 22.71,20.07 C30.P$1
  Top 0.356: C30.P$1 24.52,19.08 L8.P$2 24.83,18.25 24.56,17.98 C6.P$1
GND  (via drill 0.25, 0.36, 1.02, 3.56 pad 5.08)
  Top 0.254: U1.9 16.79,22.07 U1.8 | U1.31 v21.7,21.56 v21.71,21.57 | U1.18 17.29,17.19 17.04,16.94 C19.P$2
  Top 0.305: v19.43,19.43 19.57,19.57 U1.27 21.75,19.57 v21.77,19.58 | U1.11 16.75,21.07 16.89,21.21 v17.65,21.21 | U1.31 19.96,21.57 19.94,21.59 19.81,21.59 v19.43,21.21 | U1.18 17.29,19.07 v17.65,19.43 | U1.21 18.79,19.18 v18.54,19.43
  Top 0.508: X2.2 38.73,83.31 D2.A
  Top 1.524: X2.2 38.73,73.41 37.44,72.11 C33.- 37.44,69.11 43.2,63.35 v43.2,33.88
  other vias: 1.65,13.72 3.45,13.72 5.94,13.72 7.32,14.73 8.2,15.62 8.33,16.51 9.98,17.65 10.87,18.54 1.65,11.68 3.43,11.68 6.22,11.81 7.87,12.7 8.76,13.84 9.37,14.5 10.74,15.7 11.4,16.46 11.84,16.99 13.69,18.87 1.09,26.92 2.72,26.95 4.5,26.95 6.17,26.92 7.44,25.78 8.38,24.54 9.53,23.42 1.02,28.96 2.67,28.96 4.57,28.96 6.73,28.7 8.13,27.69 8.89,26.8 9.53,26.04 12.19,23.37 13.59,21.84 15.62,24.21 14.81,7.49 49.66,21.72 47.37,21.59 44.96,21.59 42.93,21.59 40.13,21.59 37.34,21.84 32.89,21.72 30.73,21.46 28.83,21.46 26.8,21.46 27.3,19.68 25.78,19.81 28.96,19.68 31.5,19.56 34.8,19.56 36.7,19.56 39.88,19.56 45.09,19.68 47.5,19.81 49.66,19.56 5.08,99.06 5.08,5.08 45.72,5.08 8,20.32 3.81,21.84 5.97,17.53 19.81,8.25 25.78,12.83 21.06,17.93 28.19,16 23.5,17.91 30.1,12.37 38.48,16.38 40.64,17.53 41.4,14.35 41.66,16.51 36.45,30.1 22.99,31.62 20.45,31.24 18.16,31.37 18.54,21.21 17.65,20.32 18.54,20.32 19.43,20.32 8,21.34 8,19.3 11.2,14.61 22.99,16.13 13.34,29.34 11.68,28.83 34.04,36.83 15.9,26.67 15.14,26.67 22.38,23.62 24.49,24.84 24.49,24.1 25.86,17.55 25.86,16.71 13.21,22.86 31.57,15.24 12.98,26.72 13.69,26.72 14.12,24.05 11.43,24.13 24.51,15.37 30.89,12.34 33.99,17.02 34.87,17.02 42.24,11.18 28.32,34.16 28.32,31.11 27.94,25.27 27.94,28.96 11.58,11.73 12.45,11.76 14.22,15.09 13.11,14.2 19.53,12.75 15.19,16.08 22.78,14.05 21.64,15.42 22.71,17.12 32.79,7.01 32.79,6.25 35.97,9.42
  pour Top (isolate 0.305, rank 2, no thermals): 0,34.54 0,0 50.8,0 50.8,34.54
  pour Route2: 0,34.67 0,0 50.8,0 50.8,34.67
  pour Bottom (isolate 0.305, rank 2, no thermals): 0,34.67 0,0 50.8,0 50.8,34.67
  pour Bottom (isolate 0.305, rank 2): 0.13,104.01 34.54,104.1 34.54,35.94 0,35.94 0,103.89
  pour Top (isolate 0.305): 0.13,104.01 34.54,104.1 34.54,35.94 0,35.94 0,103.89
  pour Route2 (isolate 0.305): 0,35.94 34.42,35.94 34.42,104.01 0.13,104.01
  pour Bottom (isolate 0.203, no thermals): 30.23,36.45 31.24,36.45 31.24,33.91 30.23,33.91
  pour Route2 (isolate 0.203, no thermals): 30.23,36.58 31.24,36.58 31.24,34.04 30.23,34.04
  pour Route15 (isolate 0.305): 0,35.94 34.42,35.94 34.42,104.01 0.13,104.01
LD  (via drill 0.25)
  Top 0.254: U1.25 21.43,18.57 v21.97,18.03
  Top 0.356: R7.P$2 31.88,34.11 31.32,34.67 29.92,34.67 29.44,35.15 29.44,36.93 J3.2
  Bottom 0.254: 29.46,25.53 v21.97,18.03
  Bottom 0.356: U$1.8 15.37,77.85 31.75,77.85 32.13,77.47 32.13,40.77 29.46,38.1 J3.2 29.46,25.53
LE  (via drill 0.25)
  Top 0.254: U1.3 19.29,24.63 v19.68,25.02
  Top 0.356: R18.P$2 R17.P$2 16.76,33.49 J3.7
  Bottom 0.356: v19.68,25.02 19.75,25.09 19.76,25.09 19.76,27.36 16.76,30.35 J3.7 16.76,63.5 15.11,65.15 12.95,65.15 11.56,66.55 11.56,72.01 13.59,74.04 U$1.10/CS
MUXOUT  (via drill 0.25, 0.35)
  Top 0.254: U1.30 21.1,21.08 22.35,21.08 v22.48,21.21
  Top 0.356: R8.P$2 30.39,29.97 v24.38,29.97
  Bottom 0.356: U$1.39/A20 26.04,58.8 24.38,57.15 J3.4 v24.38,29.97 24.38,26.92 23.24,25.78 23.24,21.97 v22.48,21.21
N$1
  Top 0.356: C26.P$1 12.37,21.92 | 12.37,21.92 L2.2 | R23.P$2 12.37,21.8 12.37,21.92
N$2
  Top 0.356: TRIGGER1.P$1 U$1.4/CANRX
N$3
  Top 0.356: TRIGGER2.P$1 2.92,70.36 7.11,74.55 7.11,82.42 8.89,84.2 U$1.6
N$4
  Top 0.356: R27.P$2 12.4,18.87 L3.1 11.67,17.99 C35.P$1
N$5
  Top 0.356: 535L250X2GT5.OUTPUT@6 39.37,14.8 39.37,18.41 39.62,18.67 41.11,18.67 R59.P$2
N$6
  Top 0.356: REFIN.P$1 49.21,20.59 R10.P$1 R59.P$1 41.52,20.6 C11.P$1
N$7
  Top 0.356: C40.P$1 34.47,15.37 | L10.P$1 32.38,13.84 32.9,14.36 535L250X2GT5.VCC@9
  Top 0.508: C10.P$1 31.85,13.61 L10.P$1
  Top 0.635: 34.47,15.37 34.47,14.37 535L250X2GT5.VCC@9
N$8
  Top 0.356: C12.P$1 35.49,20.57 R9.P$1 C11.P$2
N$9
  Top 0.356: 535L250X2GT5.VCFILTER@7 37.3,15.83 C37.P$1
N$10
  Top 0.356: R11.P$1 33.91,30.44 R6.P$2 | R7.P$1 31.88,30.44 R8.P$1 R6.P$2 | R6.P$2 33.67,27 33.7,27 34.16,26.54 D1.2
N$11
  Top 0.356: 14.16,12.65 R1.P$1 14.16,10.68 14.45,10.39 16.26,10.39 16.64,10.77 16.64,11.42
  Top 0.508: R4.P$2 14.16,12.65 | 16.64,11.42 R5.P$1
N$12
  Top 0.356: C2.P$2 15.6,11.52
  Top 0.508: 15.6,11.52 R1.P$2
N$13
  cutout Top: 16.54,27.05 17.91,27.05 17.91,26.42 16.54,26.42
  cutout Top: 11.05,26.8 12.47,26.8 12.47,26.24 11.05,26.24
  cutout Top: 25.27,18.06 25.27,19.43 25.91,19.43 25.91,18.06
  cutout Top: 24,22.12 24,23.49 24.64,23.49 24.64,22.12
  cutout Top: 11.53,10.67 10.16,10.67 10.16,11.3 11.53,11.3
  cutout Top: 33.12,12.19 31.75,12.19 31.75,12.83 33.12,12.83
  cutout Top: 33.27,8.99 33.27,7.62 32.64,7.62 32.64,8.99
N$14  (via drill 1.02)
  Top 0.508: L12.P$1 v48.64,35.31 | v28.83,4.57 26.81,4.57 R3.P$1 24.82,5.02 24.75,5.08 | C4.P$1 24.75,5.08 | 24.75,5.08 24.75,5.37 U3.1
  Bottom 1.524: v48.64,35.31 41.5,28.17 41.5,19.71 42.7,18.52 43.71,17.5 43.71,14.12 43.69,14.1 43.69,10.03 38.23,4.57 v28.83,4.57
N$15
  Top 0.508: L13.P$1 44.96,88.39 35.94,97.41 35.94,100.84 34.8,101.98 U$1.VIN
N$17
  Top 0.356: L4.P$1 C26.P$2
N$18
  Top 0.356: C35.P$2 L1.P$1
N$19
  Top 0.254: J1.P$1 5.84,27.94
  Top 0.356: L4.P$2 7.37,27.18 arc44 5.84,27.94
N$20
  Top 0.254: J2.P$1 5.84,12.7
  Top 0.356: L1.P$2 7.37,13.46 arc-44 5.84,12.7 | L1.P$2
N$21
  Top 0.508: U3.3 26.34,7.55 R25.P$1 26.39,6.54 R3.P$2
N$22
  Top 0.508: R24.P$1 40.25,30.13 U2.3
  Top 0.813: R22.P$2 R24.P$1
N$23
  Top 0.254: U1.24 20.29,17.07 20.57,16.79 C18.P$1
N$24
  Top 0.356: R10.P$2 43.56,10.3 U$3.P$2
N$25
  Top 0.508: 44.32,32.13 44.45,32 C32.P$1 42.64,30.47 U2.1 | 44.32,32.13 R22.P$1 | L11.P$1 45.72,33.53 44.32,32.13
N$26
  Top 0.356: R38.P$1 D5.2
N$27
  Top 0.356: C23.P$1 36.07,8.06
  Top 0.61: C22.P$1 34.06,6.6 | 34.06,6.6 35.87,6.6 U$3.P$1 36.07,6.87 36.07,8.06 | L14.P$1 34.06,7.83 34.06,6.6
PDRF  (via drill 0.25)
  Top 0.254: U1.26 21.11,19.05 22.27,19.05 v22.31,19.09
  Top 0.356: R14.P$2 R13.P$1 J3.3
  Bottom 0.254: v22.31,19.09 26.84,23.62
  Bottom 0.356: J3.3 26.92,23.7 26.84,23.62
REFIN
  Top 0.356: U1.29 32.29,20.57 C12.P$2
RFOUTAM
  Top 0.254: U1.13 15.24,20.07 arc53 14.99,19.94 arc-83 R27.P$1
RFOUTAP
  Top 0.254: U1.12 15.24,20.57 arc-53 14.99,20.7 arc83 R23.P$1
RSET
  Top 0.254: U1.22 19.29,14.87 20.07,14.1 R12.P$2
SVDD
  Top 0.254: U1.32 22.05,22.07 C28.P$1
  Top 0.356: C28.P$1 23.1,22.37 L5.P$2 23.5,22.85
  Top 0.508: C14.P$1 23.22,23.51 23.23,23.5 23.23,23.11 23.5,22.85
SW  (via drill 0.25, 0.36)
  Top 0.305: U1.5 18.29,23.87 18.29,23.88 v18.26,23.88
  Top 0.356: R5.P$2 18.82,11.43 v18.85,11.45
  Route15 0.254: v18.85,11.45 18.85,16.08 16.99,17.93 16.99,22.61 v18.26,23.88
TEMP
  Top 0.254: 17.79,16.42 C19.P$1
  Top 0.305: U1.19 17.79,16.42
VCO  (via drill 0.36)
  Top 0.254: U1.16 16.74,18.57 16.74,18.52 16.79,18.52 U1.17
  Top 0.508: L9.P$2 10.47,12.92 C17.P$1 v11.99,13.59 | v14.86,16.89 14.86,18.01 C38.P$1
  Route15 0.508: v11.99,13.59 11.99,14.91 13.97,16.89 v14.86,16.89
  pour Top (isolate 0.203, no thermals): 14.86,17.78 14.86,18.16 14.99,18.29 15.49,18.29 15.62,18.41 15.62,18.54 16.64,18.54 16.76,18.41 16.76,17.65 16.64,17.53 16.38,17.53 15.37,17.53 15.11,17.78
VCOM
  Top 0.254: U1.23 19.79,15.94 C20.P$1
VDD  (via drill 0.35, 0.36, 0.4, 0.51)
  Top 0.356: R18.P$1 R19.P$1 v12.83,30.99 | R13.P$2 26.25,30.86 v25.78,30.86 | R11.P$2 v33.91,34.16 | 16.55,27.9 16.5,27.9 v16.48,27.89 | 10.63,10.41 v10.79,10.41 | L8.P$1 26.81,18.77 v27.15,18.43 C5.P$1 | R38.P$2 30.35,24.13 v30.33,24.15
  Top 0.508: C7.P$1 16.49,27.96 16.55,27.9 | v16.48,27.89 16.83,27.89 L6.P$1 | L5.P$1 25.59,23.37 v25.65,23.37 25.75,23.46 C13.P$1 | L7.P$1 11.79,27.74 v12.09,28.04 13.23,28.04 C69.P$1 | L10.P$2 v32.38,10.92 32.28,11.03 C9.P$1 | 42.23,25.43 U2.5 42.24,27.58 v43.79,27.58 | C34.P$1 42.18,25.43 VDD.TP | L9.P$1 10.36,10.68 10.63,10.41 11.91,10.41 C16.P$1
  Top 0.61: 42.23,25.43 C34.P$1 | v32.26,9.27 32.14,9.16 L14.P$2 31.6,7.72 C21.P$1
  pour Route15 (isolate 0.305): 2.54,34.29 2.54,2.54 48.26,2.54 48.26,34.29
VOUT  (via drill 0.51)
  Top 0.356: C24.P$1 C25.P$1 | C25.P$1 C36.P$1 | C25.P$1 9.95,20.32
  Top 0.508: VOUT.TP C27.P$1 19.67,5.71 v18.54,5.71
  Top 0.61: U3.5 19.91,5.65 C27.P$1
  Top 0.813: v10.79,20.32 L2.1 | L3.2 v10.79,20.32 | v10.79,20.32 | 9.95,20.32 v10.79,20.32 | v10.79,20.32
  Route15 0.508: v18.54,5.71 17.78,4.95 11.05,4.95 9.65,6.35 9.65,11.18 10.31,11.84 10.31,15.01 9.91,15.41 9.91,16.51 8.99,17.42 8.99,18.77 10.54,20.32 v10.79,20.32
VP
  Top 0.254: U1.6 17.79,23.6 17.73,23.66 C31.P$1
  Top 0.356: C31.P$1 17.73,25.04 17.63,25.15 17.63,25.59 L6.P$2 17.21,25.98
  Top 0.508: C8.P$1 16.34,25.43 16.89,25.98 17.21,25.98
VTUNE
  Top 0.254: R2.P$1 17.08,12.85 17.58,12.85 17.8,13.08 17.8,15.04 18.05,15.28 C3.P$1
  Top 0.305: U1.20 18.29,17.01 18.54,16.76 18.54,15.3 C3.P$1

### Text on the board
tNames: +5V | GND | ADF4351 | Wideband Synthesizer | Power On | CE | LE | DATA | CLK | PDRF | LD | GND | MUXOUT | Lock Detect | Pwr | Remove R59 and L10 | when using external reference | Remove R10 and L14 | when using external reference